# Altium project Control_Quadri.PrjPCB
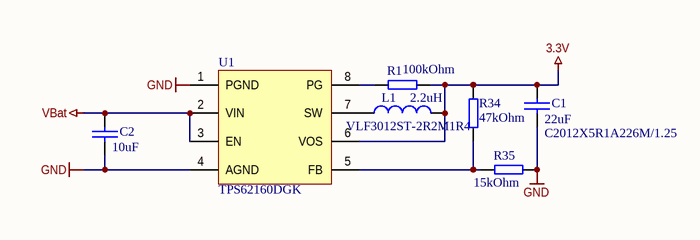
[diagram p0: Alimentation.SchDoc]
6 sheets, 101 parts. Net scope: flat (ports and power ports of the same name join across sheets).
Board file: PCB1.PcbDoc
Sheets:
  Alimentation.SchDoc
  Microcontroleur.SchDoc
  ControlCommande&Motors.SchDoc
  MesureAlimentation.SchDoc
  Capteurs.SchDoc
  InterfaceDataTelemetrie.SchDoc

## Sheet Alimentation.SchDoc
size A3; Organization: Altium Limited; Address1: Laboratoire de Systèmes Embarqués; Address2: 7, rue de la Serre; Address3: 2610 Saint-Imier / Switzerland; PageSetup: Record=PageOptions|CenterHorizontal=True|CenterVertical=True|PrintScale=0.24|XCorrection=1.00|YCorrection=1.00|PrintKind=0|BorderSize=5000000|LeftOffset=0|BottomOffset=0|Orientation=2|PaperLength=1000|PaperWidth=1000|Scale=100|PaperSource=7|PrintQuality=-4|MediaType=1|DitherType=10|PaperKind=A4|PrintScaleMode=1

### Parts
C1  C2012X5R1A226M/1.25  value 22uF  [080501]
C2  value 10uF  [080501]  (hidden comment: GRM21BR61E106KA73L)
L1  VLF3012ST-2R2M1R4  value 2.2uH  [InductanceAlim]
R1  value 100kOhm  [080501]  (hidden comment: ERJ-6GEYJ104V)
R34  value 47kOhm  [080501]  (hidden comment: ERJ-6GEYJ104V)
R35  value 15kOhm  [080501]  (hidden comment: ERJ-6GEYJ104V)
U1  TPS62160DGK  [TSOP65P490-8AM]

### Nets
3.3V: C1.1 L1.2 R1.2 R34.2 U1.6(VOS)
GND: C1.2 C2.2 R35.1 U1.1(PGND) U1.4(AGND)
VBat: C2.1 U1.2(VIN) U1.3(EN)
NetL1_1: L1.1 U1.7(SW)
NetR1_1: R1.1 U1.8(PG)
NetR34_1: R34.1 R35.2 U1.5(FB)

### Notes on the sheet
- Title
- Size:
- Date:
- A3
- Author:
- Time:
- Revision:
- Sheet
- of
- File:

### Library data of the parts
C1 C2 = CAPA: EtatCommande: Interne; Text Field1: CAPA; Supplier 1: Digi-Key
  C1: Supplier Part Number 1: 445-7665-1-ND
  C2: Supplier Part Number 1: 490-5523-1-ND
L1 = INDUCTOR: EtatCommande: Commandé; Text Field1: INDUCTOR; Supplier 1: Digi-Key; Supplier Part Number 1: 445-4200-1-ND
R1 R34 R35 = RES: Text Field1: RESISTANCE; EtatCommande: Interne; Supplier 1: Digi-Key; Supplier Part Number 1: P100KACT-ND
U1 = TPS62160: IC BUCK SYNC ADJ 1A 8MSOP; EtatCommande: Commandé; Part Name: TPS62160DGK; Supplier 1: Digi-Key; Supplier Part Number 1: 296-30318-1-ND

## Sheet Microcontroleur.SchDoc
size A3; PageSetup: Record=PageOptions|CenterHorizontal=True|CenterVertical=True|PrintScale=0.24|XCorrection=1.00|YCorrection=1.00|PrintKind=0|BorderSize=5000000|LeftOffset=0|BottomOffset=0|Orientation=2|PaperLength=1000|PaperWidth=1000|Scale=100|PaperSource=7|PrintQuality=-4|MediaType=1|DitherType=10|PaperKind=A4|PrintScaleMode=1; Organization: Altium Limited; Address1: Laboratoire de Systèmes Embarqués; Address2: 7, rue de la Serre; Address3: 2610 Saint-Imier / Switzerland
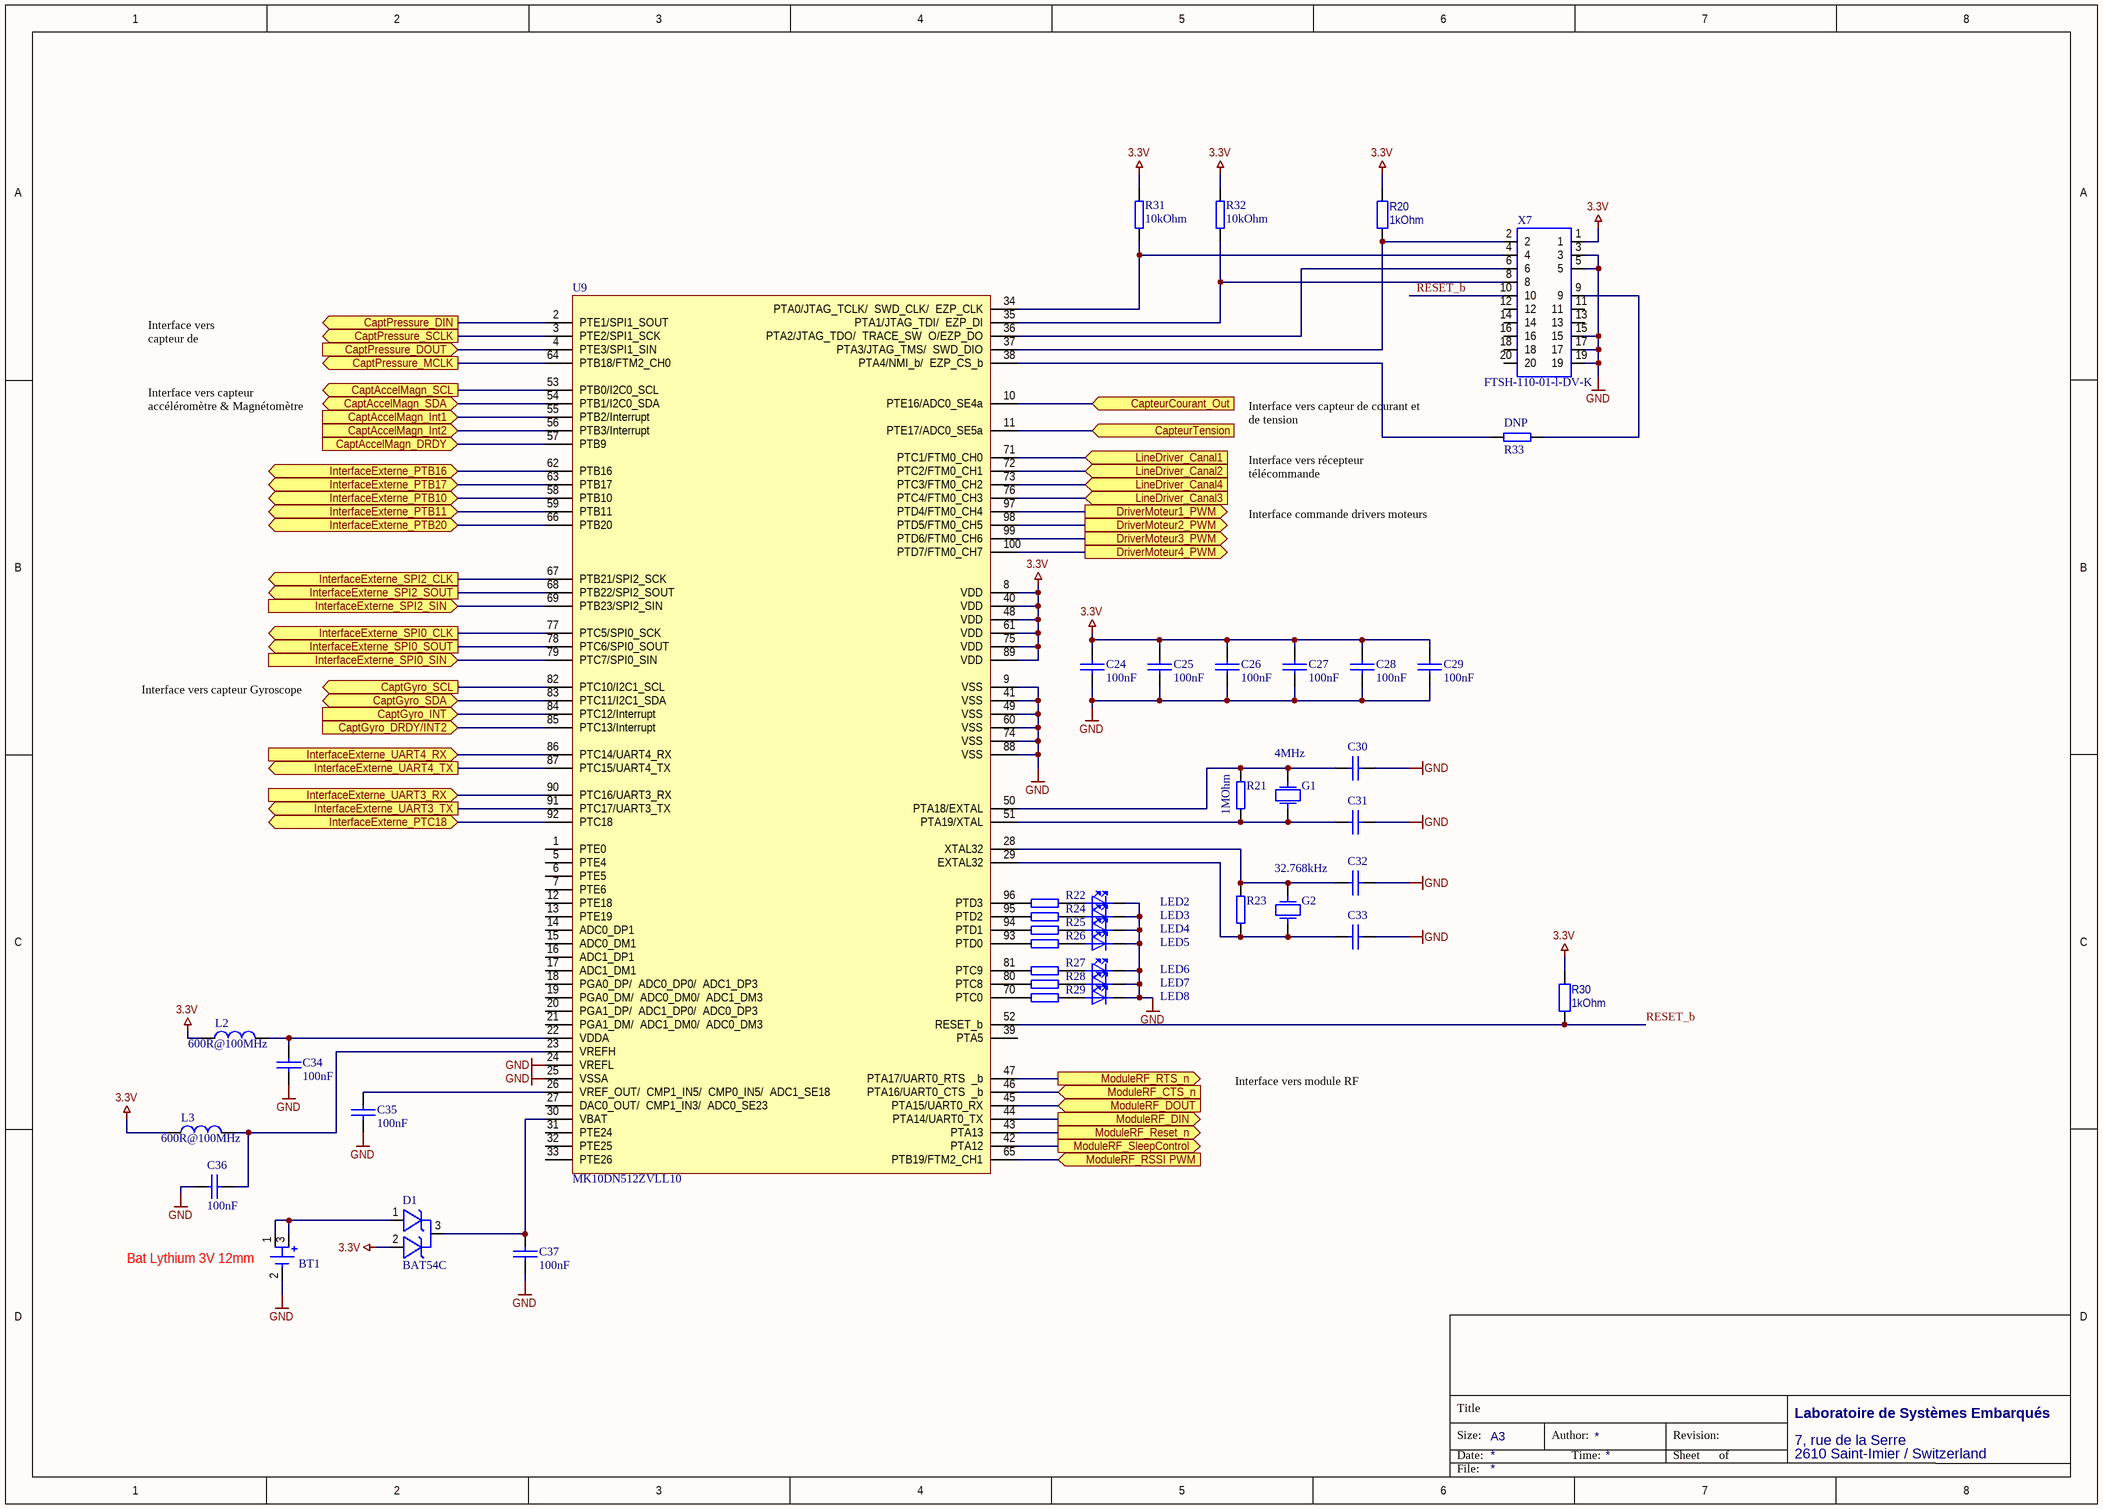
[diagram p1: Microcontroleur.SchDoc]

### Parts
BT1  3000TR  [3000TR]  (value not drawn)
C24  value 100nF  [060301]  (hidden comment: GRM188R71E104KA01D)
C25  value 100nF  [060301]  (hidden comment: GRM188R71E104KA01D)
C26  value 100nF  [060301]  (hidden comment: GRM188R71E104KA01D)
C27  value 100nF  [060301]  (hidden comment: GRM188R71E104KA01D)
C28  value 100nF  [060301]  (hidden comment: GRM188R71E104KA01D)
C29  value 100nF  [060301]  (hidden comment: GRM188R71E104KA01D)
C30  GQM2195C1H200JB01D  [060301]  (value not drawn)
C31  GQM2195C1H200JB01D  [080501]  (value not drawn)
C32  GRM21A5C2E120JW01D  [080501]  (value not drawn)
C33  GRM21A5C2E120JW01D  [080501]  (value not drawn)
C34  value 100nF  [060301]  (hidden comment: GRM188R71E104KA01D)
C35  value 100nF  [060301]  (hidden comment: GRM188R71E104KA01D)
C36  value 100nF  [060301]  (hidden comment: GRM188R71E104KA01D)
C37  value 100nF  [060301]  (hidden comment: GRM188R71E104KA01D)
D1  BAT54C  [SOT2301]
G1  value 4MHz  [Crystal]  (hidden comment: ECS-40-20-5PX-TR)
G2  value 32.768kHz  [Crystal2]  (hidden comment: ECS-.327-12.5-38)
L2  value 600R@100MHz  [080501]  (hidden comment: BLM21AG601SN1D)
L3  value 600R@100MHz  [080501]  (hidden comment: BLM21AG601SN1D)
LED2  LG L29K-G2J1-24-Z  [060301_led]  (value not drawn)
LED3  LG L29K-G2J1-24-Z  [060301_led]  (value not drawn)
LED4  LG L29K-G2J1-24-Z  [060301_led]  (value not drawn)
LED5  LG L29K-G2J1-24-Z  [060301_led]  (value not drawn)
LED6  LG L29K-G2J1-24-Z  [060301_led]  (value not drawn)
LED7  LG L29K-G2J1-24-Z  [060301_led]  (value not drawn)
LED8  LG L29K-G2J1-24-Z  [060301_led]  (value not drawn)
R20  value 1kOhm  [060301]  (hidden comment: RC0603FR-071KL)
R21  value 1MOhm  [080501]  (hidden comment: RMCF0805JT820R)
R22  RMCF0805JT820R  [080501]  (value not drawn)
R23  ERJ-6GEYJ103V  [080501]  (value not drawn)
R24  RMCF0805JT820R  [080501]  (value not drawn)
R25  RMCF0805JT820R  [080501]  (value not drawn)
R26  RMCF0805JT820R  [080501]  (value not drawn)
R27  RMCF0805JT820R  [080501]  (value not drawn)
R28  RMCF0805JT820R  [080501]  (value not drawn)
R29  RMCF0805JT820R  [080501]  (value not drawn)
R30  value 1kOhm  [060301]  (hidden comment: RC0603FR-071KL)
R31  value 10kOhm  [080501]  (hidden comment: ERJ-6GEYJ103V)
R32  value 10kOhm  [080501]  (hidden comment: ERJ-6GEYJ103V)
R33  value DNP  [080501]  (hidden comment: RMCF0805JT820R)
U9  MK10DN512ZVLL10  [QFP100-1]
X7  FTSH-110-01-l-DV-K  [FTSH-110-01-X-DV-EJ]

### Ports
CaptAccelMagn_DRDY (in), CaptAccelMagn_Int1 (in), CaptAccelMagn_Int2 (in), CaptAccelMagn_SCL (out), CaptAccelMagn_SDA (bidir), CapteurCourant_Out (in), CapteurTension (in), CaptGyro_DRDY/INT2 (in), CaptGyro_INT (in), CaptGyro_SCL (out), CaptGyro_SDA (bidir), CaptPressure_DIN (out), CaptPressure_DOUT (in), CaptPressure_MCLK (out), CaptPressure_SCLK (out), DriverMoteur1_PWM (out), DriverMoteur2_PWM (out), DriverMoteur3_PWM (out), DriverMoteur4_PWM (out), InterfaceExterne_PTB10 (bidir), InterfaceExterne_PTB11 (bidir), InterfaceExterne_PTB16 (bidir), InterfaceExterne_PTB17 (bidir), InterfaceExterne_PTB20 (bidir), InterfaceExterne_PTC18 (bidir), InterfaceExterne_SPI0_CLK (out), InterfaceExterne_SPI0_SIN (in), InterfaceExterne_SPI0_SOUT (out), InterfaceExterne_SPI2_CLK (out), InterfaceExterne_SPI2_SIN (in), InterfaceExterne_SPI2_SOUT (out), InterfaceExterne_UART3_RX (in), InterfaceExterne_UART3_TX (out), InterfaceExterne_UART4_RX (in), InterfaceExterne_UART4_TX (out), LineDriver_Canal1 (in), LineDriver_Canal2 (in), LineDriver_Canal3 (in), LineDriver_Canal4 (in), ModuleRF_CTS_n (in), ModuleRF_DIN (out), ModuleRF_DOUT (in), ModuleRF_Reset_n (out), ModuleRF_RSSI PWM (in), ModuleRF_RTS_n (out), ModuleRF_SleepControl (out)

### Nets
3.3V: C24.1 C25.1 C26.1 C27.1 C28.1 C29.1 D1.2(C2) L2.1 L3.1 R20.1 R30.1 R31.2 R32.2 U9.8(VDD) U9.40(VDD) U9.48(VDD) U9.61(VDD) U9.75(VDD) U9.89(VDD) X7.1
GND: BT1.2(C) C24.2 C25.2 C26.2 C27.2 C28.2 C29.2 C30.2 C31.2 C32.2 C33.2 C34.2 C35.1 C36.1 C37.1 LED2.2(CATHODE) LED3.2(CATHODE) LED4.2(CATHODE) LED5.2(CATHODE) LED6.2(CATHODE) LED7.2(CATHODE) LED8.2(CATHODE) U9.9(VSS) U9.24(VREFL) U9.25(VSSA) U9.41(VSS) U9.49(VSS) U9.60(VSS) U9.74(VSS) U9.88(VSS) X7.3 X7.5 X7.15 X7.17 X7.19
RESET_b: R30.2 U9.52(RESET_b) X7.10
NetBT1_1: BT1.1(A1) BT1.3(A2) D1.1(C1)
NetC23_1: U9.10(PTE16/ADC0_SE4a) ; port CapteurCourant_Out
NetC30_1: C30.1 G1.1 R21.2 U9.50(PTA18/EXTAL)
NetC31_1: C31.1 G1.2 R21.1 U9.51(PTA19/XTAL)
NetC32_1: C32.1 G2.2 R23.2 U9.28(XTAL32)
NetC33_1: C33.1 G2.1 R23.1 U9.29(EXTAL32)
NetC34_1: C34.1 L2.2 U9.22(VDDA)
NetC35_2: C35.2 U9.26(VREF_OUT/__CMP1_IN5/__CMP0_IN5/__ADC1_SE18)
NetC36_2: C36.2 L3.2 U9.23(VREFH)
NetC37_2: C37.2 D1.3(Anode) U9.30(VBAT)
NetLED2_1: LED2.1(ANODE) R24.2
NetLED3_1: LED3.1(ANODE) R22.2
NetLED4_1: LED4.1(ANODE) R25.2
NetLED5_1: LED5.1(ANODE) R26.2
NetLED6_1: LED6.1(ANODE) R27.2
NetLED7_1: LED7.1(ANODE) R28.2
NetLED8_1: LED8.1(ANODE) R29.2
NetR2_1: U9.53(PTB0/I2C0_SCL) ; port CaptAccelMagn_SCL
NetR3_1: U9.54(PTB1/I2C0_SDA) ; port CaptAccelMagn_SDA
NetR4_1: U9.82(PTC10/I2C1_SCL) ; port CaptGyro_SCL
NetR5_1: U9.83(PTC11/I2C1_SDA) ; port CaptGyro_SDA
NetR18_2: U9.11(PTE17/ADC0_SE5a) ; port CapteurTension
NetR20_2: R20.2 U9.37(PTA3/JTAG_TMS/__SWD_DIO) X7.2
NetR22_1: R22.1 U9.96(PTD3)
NetR24_1: R24.1 U9.95(PTD2)
NetR25_1: R25.1 U9.94(PTD1)
NetR26_1: R26.1 U9.93(PTD0)
NetR27_1: R27.1 U9.81(PTC9)
NetR28_1: R28.1 U9.80(PTC8)
NetR29_1: R29.1 U9.70(PTC0)
NetR31_1: R31.1 U9.34(PTA0/JTAG_TCLK/__SWD_CLK/__EZP_CLK) X7.4
NetR32_1: R32.1 U9.35(PTA1/JTAG_TDI/__EZP_DI) X7.8
NetR33_1: R33.1 X7.9
NetR33_2: R33.2 U9.38(PTA4/NMI_b/__EZP_CS_b)
NetU2_2: U9.3(PTE2/SPI1_SCK) ; port CaptPressure_SCLK
NetU2_3: U9.4(PTE3/SPI1_SIN) ; port CaptPressure_DOUT
NetU2_4: U9.2(PTE1/SPI1_SOUT) ; port CaptPressure_DIN
NetU2_5: U9.64(PTB18/FTM2_CH0) ; port CaptPressure_MCLK
NetU3_4: U9.56(PTB3/Interrupt) ; port CaptAccelMagn_Int2
NetU3_5: U9.55(PTB2/Interrupt) ; port CaptAccelMagn_Int1
NetU3_9: U9.57(PTB9) ; port CaptAccelMagn_DRDY
NetU4_6: U9.85(PTC13/Interrupt) ; port CaptGyro_DRDY/INT2
NetU4_7: U9.84(PTC12/Interrupt) ; port CaptGyro_INT
NetU5_2: U9.71(PTC1/FTM0_CH0) ; port LineDriver_Canal1
NetU5_4: U9.72(PTC2/FTM0_CH1) ; port LineDriver_Canal2
NetU5_6: U9.76(PTC4/FTM0_CH3) ; port LineDriver_Canal3
NetU5_8: U9.73(PTC3/FTM0_CH2) ; port LineDriver_Canal4
NetU6_1: U9.97(PTD4/FTM0_CH4) ; port DriverMoteur1_PWM
NetU6_3: U9.98(PTD5/FTM0_CH5) ; port DriverMoteur2_PWM
NetU6_5: U9.99(PTD6/FTM0_CH6) ; port DriverMoteur3_PWM
NetU6_9: U9.100(PTD7/FTM0_CH7) ; port DriverMoteur4_PWM
NetU7_2: U9.45(PTA15/UART0_RX) ; port ModuleRF_DOUT
NetU7_3: U9.44(PTA14/UART0_TX) ; port ModuleRF_DIN
NetU7_5: U9.43(PTA13) ; port ModuleRF_Reset_n
NetU7_6: U9.65(PTB19/FTM2_CH1) ; port ModuleRF_RSSI PWM
NetU7_9: U9.42(PTA12) ; port ModuleRF_SleepControl
NetU7_12: U9.46(PTA16/UART0_CTS___b) ; port ModuleRF_CTS_n
NetU7_16: U9.47(PTA17/UART0_RTS___b) ; port ModuleRF_RTS_n
NetU9_36: U9.36(PTA2/JTAG_TDO/__TRACE_SW__O/EZP_DO) X7.6
NetU9_58: U9.58(PTB10) ; port InterfaceExterne_PTB10
NetU9_59: U9.59(PTB11) ; port InterfaceExterne_PTB11
NetU9_62: U9.62(PTB16) ; port InterfaceExterne_PTB16
NetU9_63: U9.63(PTB17) ; port InterfaceExterne_PTB17
NetU9_66: U9.66(PTB20) ; port InterfaceExterne_PTB20
NetU9_67: U9.67(PTB21/SPI2_SCK) ; port InterfaceExterne_SPI2_CLK
NetU9_68: U9.68(PTB22/SPI2_SOUT) ; port InterfaceExterne_SPI2_SOUT
NetU9_69: U9.69(PTB23/SPI2_SIN) ; port InterfaceExterne_SPI2_SIN
NetU9_77: U9.77(PTC5/SPI0_SCK) ; port InterfaceExterne_SPI0_CLK
NetU9_78: U9.78(PTC6/SPI0_SOUT) ; port InterfaceExterne_SPI0_SOUT
NetU9_79: U9.79(PTC7/SPI0_SIN) ; port InterfaceExterne_SPI0_SIN
NetU9_86: U9.86(PTC14/UART4_RX) ; port InterfaceExterne_UART4_RX
NetU9_87: U9.87(PTC15/UART4_TX) ; port InterfaceExterne_UART4_TX
NetU9_90: U9.90(PTC16/UART3_RX) ; port InterfaceExterne_UART3_RX
NetU9_91: U9.91(PTC17/UART3_TX) ; port InterfaceExterne_UART3_TX
NetU9_92: U9.92(PTC18) ; port InterfaceExterne_PTC18

Not connected (* = marked no-connect by the designer): U9 1(PTE0) 5(PTE4) 6(PTE5) 7(PTE6) 12(PTE18) 13(PTE19) 14(ADC0_DP1) 15(ADC0_DM1) 16(ADC1_DP1) 17(ADC1_DM1) 18(PGA0_DP/__ADC0_DP0/__ADC1_DP3) 19(PGA0_DM/__ADC0_DM0/__ADC1_DM3) 20(PGA1_DP/__ADC1_DP0/__ADC0_DP3) 21(PGA1_DM/__ADC1_DM0/__ADC0_DM3) 27(DAC0_OUT/__CMP1_IN3/__ADC0_SE23) 31(PTE24) 32(PTE25) 33(PTE26) 39(PTA5); X7 11 12 13 14 16 18 20

### Notes on the sheet
- Interface vers capteur de pression
- Interface vers capteur accéléromètre & Magnétomètre
- Interface vers capteur de courant et de tension
- Interface vers récepteur télécommande
- Interface commande drivers moteurs
- Interface vers capteur Gyroscope
- Interface vers module RF
- (near BT1) Bat Lythium 3V 12mm
- Title
- Size:
- Date:
- A3
- Author:
- Time:
- Revision:
- Sheet
- of
- File:

### Library data of the parts
BT1 = BAT_1: HOLDER BATTERY COIN 12MM DIA SMD; Manufacturer: Keystone Electronics; EtatCommande: Commandé; Supplier 1: Digi-Key; Supplier Part Number 1: 3000KTR-ND; Part Name: 3000TR
C24-C29 C34-C37 = CAPA: EtatCommande: Interne; Text Field1: CAPA; Supplier 1: Digi-Key; Supplier Part Number 1: 490-1524-1-ND
C30 C31 = CAPA: Value: 20pF; EtatCommande: Interne; Text Field1: CAPA; Supplier 1: Digi-Key; Supplier Part Number 1: 490-3607-1-ND
C32 C33 = CAPA: Value: 12pF; EtatCommande: Interne; Text Field1: CAPA; Supplier 1: Digi-Key; Supplier Part Number 1: 490-5531-1-ND
D1 = BAT54C: DIODE SCHTTKY CC 200MA 30V SOT23; Manufacturer: Comchip Technology; Part Name: BAT54C-G; EtatCommande: Commandé; Supplier 1: Digi-Key; Supplier Part Number 1: 641-1320-1-ND
G1 = CRYSTAL: EtatCommande: Commandé; Text Field1: CRYSTAL; Supplier 1: Digi-Key; Supplier Part Number 1: XC1238CT-ND
G2 = CRYSTAL: EtatCommande: Interne; Text Field1: CRYSTAL; Supplier 1: Digi-Key; Supplier Part Number 1: XC1616CT-ND
L2 L3 = Ferrite Bead: FERRITE CHIP 600 OHM 200MA 0805; Manufacturer: Murata Electronics; EtatCommande: Commandé; Part Name: BLM21AG601SN1D; Supplier 1: Digi-Key; Supplier Part Number 1: 490-1040-6-ND
LED2-LED8 = LED: EtatCommande: Commandé; Supplier 1: Digi-Key; Supplier Part Number 1: 475-2709-1-ND; Text Field1: LED
R20 R30 = RES: RES 1.00K OHM 1/10W 1% 0603 SMD; Manufacturer: Yageo; EtatCommande: Interne; Text Field1: RESISTANCE; Part Name: RC0603FR-071KL; Supplier 1: Digi-Key; Supplier Part Number 1: 311-1.00KHRCT-ND
R21 R31-R33 = RES: as R1 on sheet Alimentation
  R21: Supplier 1: Digi-Key; Supplier Part Number 1: RMCF0805JT820RDKR-ND
  R31 R32: Supplier 1: Digi-Key; Supplier Part Number 1: P10KACT-ND
R22 R24-R29 = RES: Text Field1: RESISTANCE; Value: 820Ohm; EtatCommande: Interne; Supplier 1: Digi-Key; Supplier Part Number 1: RMCF0805JT820RDKR-ND
R23 = RES: Text Field1: RESISTANCE; Value: 10kOhm; EtatCommande: Interne; Supplier 1: Digi-Key; Supplier Part Number 1: P10KADKR-ND
X7 = CON20_JTAG: CONN UNSHROUDED HDR 20POS .05"; Manufacturer: Samtec Inc; Part Name: FTSH-110-01-L-DV-K-P-TR; Supplier 1: Samtec Inc; Supplier Part Number 1: FTSH-110-01-L-DV-K-P-TR

## Sheet ControlCommande&Motors.SchDoc
size A3; Organization: Altium Limited; Address1: Laboratoire de Systèmes Embarqués; Address2: 7, rue de la Serre; Address3: 2610 Saint-Imier / Switzerland; PageSetup: Record=PageOptions|CenterHorizontal=True|CenterVertical=True|PrintScale=0.24|XCorrection=1.00|YCorrection=1.00|PrintKind=0|BorderSize=5000000|LeftOffset=0|BottomOffset=0|Orientation=2|PaperLength=1000|PaperWidth=1000|Scale=100|PaperSource=7|PrintQuality=-4|MediaType=1|DitherType=10|PaperKind=A4|PrintScaleMode=1
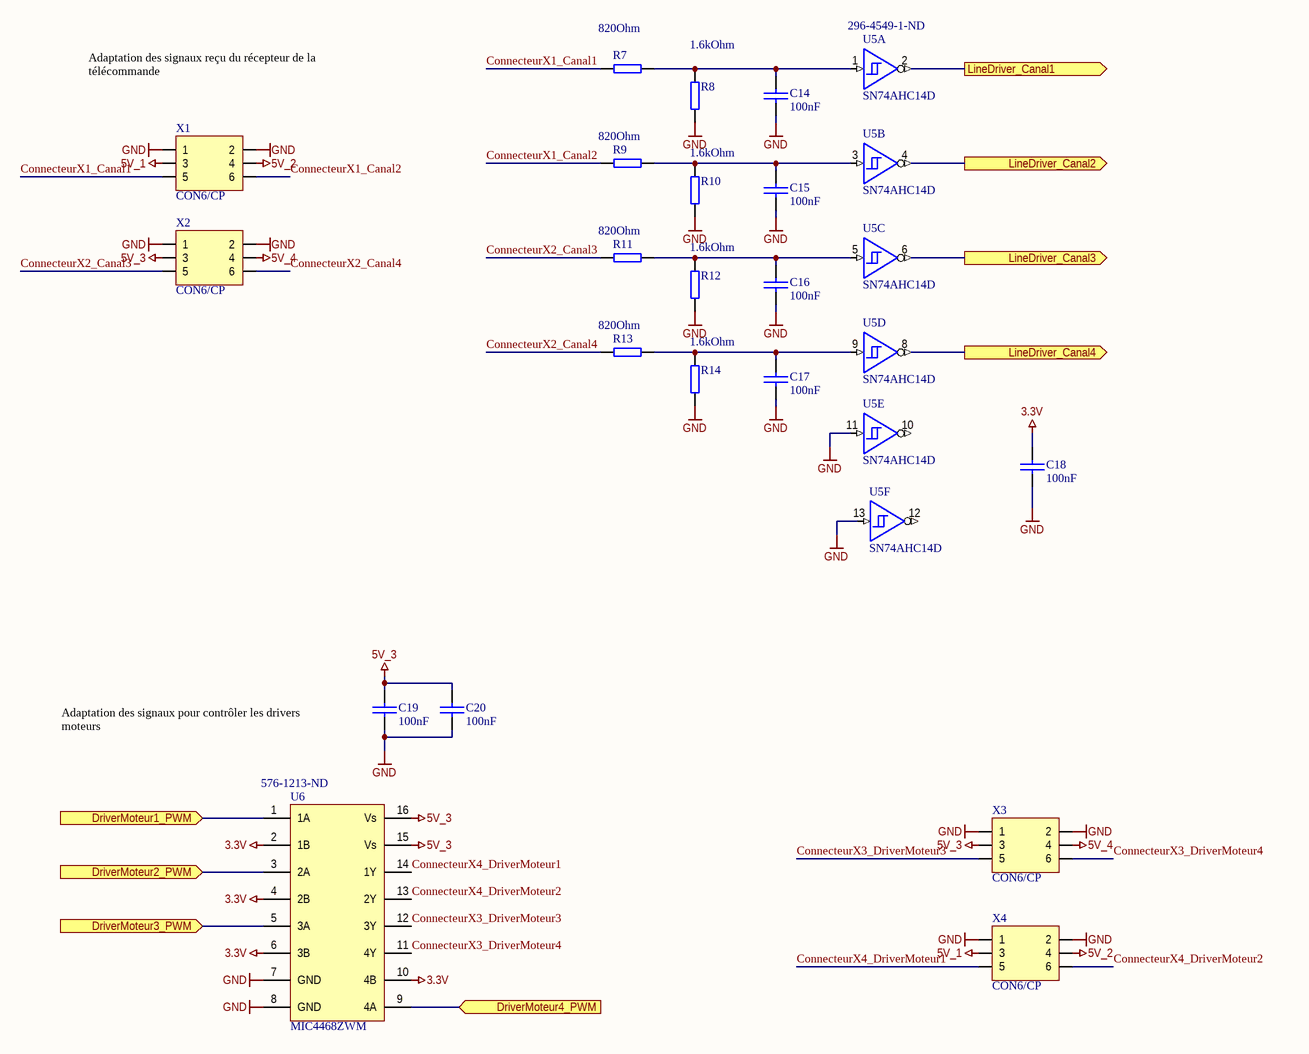
[diagram p2: ControlCommande&Motors.SchDoc]

### Parts
C14  value 100nF  [060301]  (hidden comment: GRM188R71E104KA01D)
C15  value 100nF  [060301]  (hidden comment: GRM188R71E104KA01D)
C16  value 100nF  [060301]  (hidden comment: GRM188R71E104KA01D)
C17  value 100nF  [060301]  (hidden comment: GRM188R71E104KA01D)
C18  value 100nF  [060301]  (hidden comment: GRM188R71E104KA01D)
C19  value 100nF  [060301]  (hidden comment: GRM188R71E104KA01D)
C20  value 100nF  [060301]  (hidden comment: GRM188R71E104KA01D)
R7  value 820Ohm  [080501]  (hidden comment: RMCF0805JT820R)
R8  value 1.6kOhm  [080501]  (hidden comment: ERJ-6GEYJ162V)
R9  value 820Ohm  [080501]  (hidden comment: RMCF0805JT820R)
R10  value 1.6kOhm  [080501]  (hidden comment: ERJ-6GEYJ162V)
R11  value 820Ohm  [080501]  (hidden comment: RMCF0805JT820R)
R12  value 1.6kOhm  [080501]  (hidden comment: ERJ-6GEYJ162V)
R13  value 820Ohm  [080501]  (hidden comment: RMCF0805JT820R)
R14  value 1.6kOhm  [080501]  (hidden comment: ERJ-6GEYJ162V)
U5  SN74AHC14D  Supplier Part Number 1: 296-4549-1-ND  [SO1401]  (parts A,B,C,D,E,F of 6)
U6  MIC4468ZWM  Supplier Part Number 1: 576-1213-ND  [SOIC127P1030-16M]
X1  CON6/CP  [J2X3_2.54]
X2  CON6/CP  [J2X3_2.54]
X3  CON6/CP  [J2X3_2.54]
X4  CON6/CP  [J2X3_2.54]

### Ports
DriverMoteur1_PWM (in), DriverMoteur2_PWM (in), DriverMoteur3_PWM (in), DriverMoteur4_PWM (in), LineDriver_Canal1 (out), LineDriver_Canal2 (out), LineDriver_Canal3 (out), LineDriver_Canal4 (out)

### Nets
3.3V: C18.1 U5.14(3.3V) U6.2(1B) U6.4(2B) U6.6(3B) U6.10(4B)
5V_1: X1.3 X4.3
5V_2: X1.4 X4.4
5V_3: C19.1 C20.1 U6.15(Vs) U6.16(Vs) X2.3 X3.3
5V_4: X2.4 X3.4
GND: C14.2 C15.2 C16.2 C17.2 C18.2 C19.2 C20.2 R8.2 R10.2 R12.2 R14.2 U5.7(GND) U5.11 U5.13 U6.7(GND) U6.8(GND) X1.1 X1.2 X2.1 X2.2 X3.1 X3.2 X4.1 X4.2
ConnecteurX1_Canal1: R7.1 X1.5
ConnecteurX1_Canal2: R9.1 X1.6
ConnecteurX2_Canal3: R11.1 X2.5
ConnecteurX2_Canal4: R13.1 X2.6
ConnecteurX3_DriverMoteur3: U6.12(3Y) X3.5
ConnecteurX3_DriverMoteur4: U6.11(4Y) X3.6
ConnecteurX4_DriverMoteur1: U6.14(1Y) X4.5
ConnecteurX4_DriverMoteur2: U6.13(2Y) X4.6
NetC14_1: C14.1 R7.2 R8.1 U5.1
NetC15_1: C15.1 R9.2 R10.1 U5.3
NetC16_1: C16.1 R11.2 R12.1 U5.5
NetC17_1: C17.1 R13.2 R14.1 U5.9
NetU5_2: U5.2 ; port LineDriver_Canal1
NetU5_4: U5.4 ; port LineDriver_Canal2
NetU5_6: U5.6 ; port LineDriver_Canal3
NetU5_8: U5.8 ; port LineDriver_Canal4
NetU6_1: U6.1(1A) ; port DriverMoteur1_PWM
NetU6_3: U6.3(2A) ; port DriverMoteur2_PWM
NetU6_5: U6.5(3A) ; port DriverMoteur3_PWM
NetU6_9: U6.9(4A) ; port DriverMoteur4_PWM

Not connected (* = marked no-connect by the designer): U5 10 12

### Notes on the sheet
- (near X1) Adaptation des signaux reçu du récepteur de la télécommande
- Adaptation des signaux pour contrôler les drivers moteurs
- Title
- Size:
- Date:
- A3
- Author:
- Time:
- Revision:
- Sheet
- of
- File:

### Library data of the parts
C14-C20 = CAPA: EtatCommande: Interne; Text Field1: CAPA; Supplier 1: Digi-Key; Supplier Part Number 1: 490-1524-1-ND
R7-R14 = RES: as R1 on sheet Alimentation; Supplier 1: Digi-Key
  R7 R9 R11 R13: Supplier Part Number 1: RMCF0805JT820RDKR-ND
  R8 R10 R12 R14: Supplier Part Number 1: P1.6KACT-ND
U5 = SN74AHC14D: EtatCommande: Commandé; Supplier 1: Digi-Key
U6 = MIC4468: EtatCommande: Commandé; Supplier 1: Digi-Key
X1 = CON6/CP: Connecteur récepteur télécommande cannaux 1 & 2; EtatCommande: Interne
X2 = CON6/CP: Connecteur récepteur télécommande cannaux 3 & 4; EtatCommande: Interne
X3 = CON6/CP: Connecteur contrôleur moteurs 3 (arrière) & 4 (gauche); EtatCommande: Interne
X4 = CON6/CP: Connecteur contrôleur moteurs 1 (avant) & 2 (droite); EtatCommande: Interne

## Sheet MesureAlimentation.SchDoc
size A3; Organization: Altium Limited; Address1: Laboratoire de Systèmes Embarqués; Address2: 7, rue de la Serre; Address3: 2610 Saint-Imier / Switzerland; PageSetup: Record=PageOptions|CenterHorizontal=True|CenterVertical=True|PrintScale=0.24|XCorrection=1.00|YCorrection=1.00|PrintKind=0|BorderSize=5000000|LeftOffset=0|BottomOffset=0|Orientation=2|PaperLength=1000|PaperWidth=1000|Scale=100|PaperSource=7|PrintQuality=-4|MediaType=1|DitherType=10|PaperKind=A4|PrintScaleMode=1
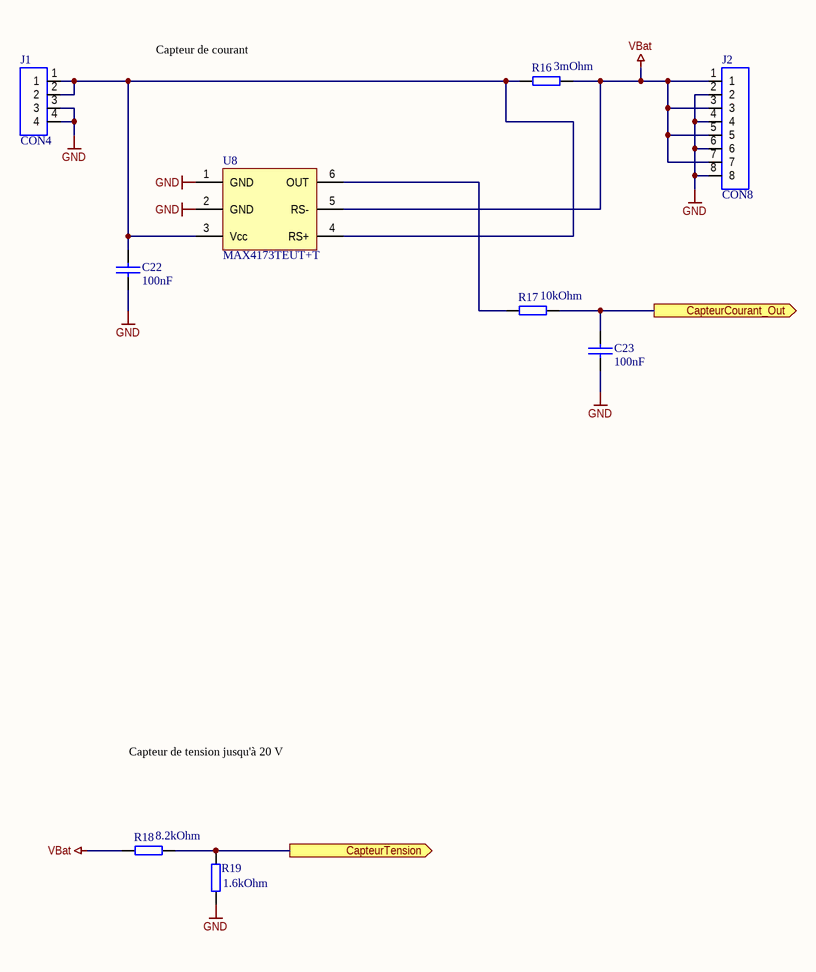
[diagram p3: MesureAlimentation.SchDoc]

### Parts
C22  value 100nF  [060301]  (hidden comment: GRM188R71E104KA01D)
C23  value 100nF  [060301]  (hidden comment: GRM188R71E104KA01D)
J1  CON4  [SL354D]
J2  CON8  [SL358D]
R16  value 3mOhm  [5.2x8.75]  (hidden comment: WSLP59313L000FEB)
R17  value 10kOhm  [080501]  (hidden comment: ERJ-6GEYJ103V)
R18  value 8.2kOhm  [080501]  (hidden comment: ERJ-6GEYJ822V)
R19  value 1.6kOhm  [080501]  (hidden comment: ERJ-6GEYJ162V)
U8  MAX4173TEUT+T  [SOT26A-6AM]

### Ports
CapteurCourant_Out (out), CapteurTension (out)

### Nets
GND: C22.2 C23.2 J1.3 J1.4 J2.2 J2.4 J2.6 J2.8 R19.2 U8.1(GND) U8.2(GND)
VBat: J2.1 J2.3 J2.5 J2.7 R16.2 R18.1 U8.5(RS-)
NetC22_1: C22.1 J1.1 J1.2 R16.1 U8.3(Vcc) U8.4(RS+)
NetC23_1: C23.1 R17.2 ; port CapteurCourant_Out
NetR17_1: R17.1 U8.6(OUT)
NetR18_2: R18.2 R19.1 ; port CapteurTension

### Notes on the sheet
- Capteur de courant
- Capteur de tension jusqu'à 20 V
- Title
- Size:
- Date:
- A3
- Author:
- Time:
- Revision:
- Sheet
- of
- File:

### Library data of the parts
C22 C23 = CAPA: EtatCommande: Interne; Text Field1: CAPA; Supplier 1: Digi-Key; Supplier Part Number 1: 490-1524-1-ND
J2 = CON8: Text Field1: CON; EtatCommande: Commandé; Supplier 1: Distrelec; Supplier Part Number 1: 141525
R16 = RES: Text Field1: RESISTANCE; EtatCommande: Commandé; Supplier 1: Digi-Key; Supplier Part Number 1: WSLPD-.003CT-ND
R17-R19 = RES: as R1 on sheet Alimentation; Supplier 1: Digi-Key
  R17: Supplier Part Number 1: P10KACT-ND
  R18: Supplier Part Number 1: P8.2KACT-ND
  R19: Supplier Part Number 1: P1.6KACT-ND
U8 = Max4173: Amplificateur capteur de courant; EtatCommande: Commandé; Supplier 1: Digi-Key; Supplier Part Number 1: MAX4173TEUT+TCT-ND

## Sheet Capteurs.SchDoc
size A3; Organization: Altium Limited; Address1: Laboratoire de Systèmes Embarqués; Address2: 7, rue de la Serre; Address3: 2610 Saint-Imier / Switzerland; PageSetup: Record=PageOptions|CenterHorizontal=True|CenterVertical=True|PrintScale=0.24|XCorrection=1.00|YCorrection=1.00|PrintKind=0|BorderSize=5000000|LeftOffset=0|BottomOffset=0|Orientation=2|PaperLength=1000|PaperWidth=1000|Scale=100|PaperSource=7|PrintQuality=-4|MediaType=1|DitherType=10|PaperKind=A4|PrintScaleMode=1
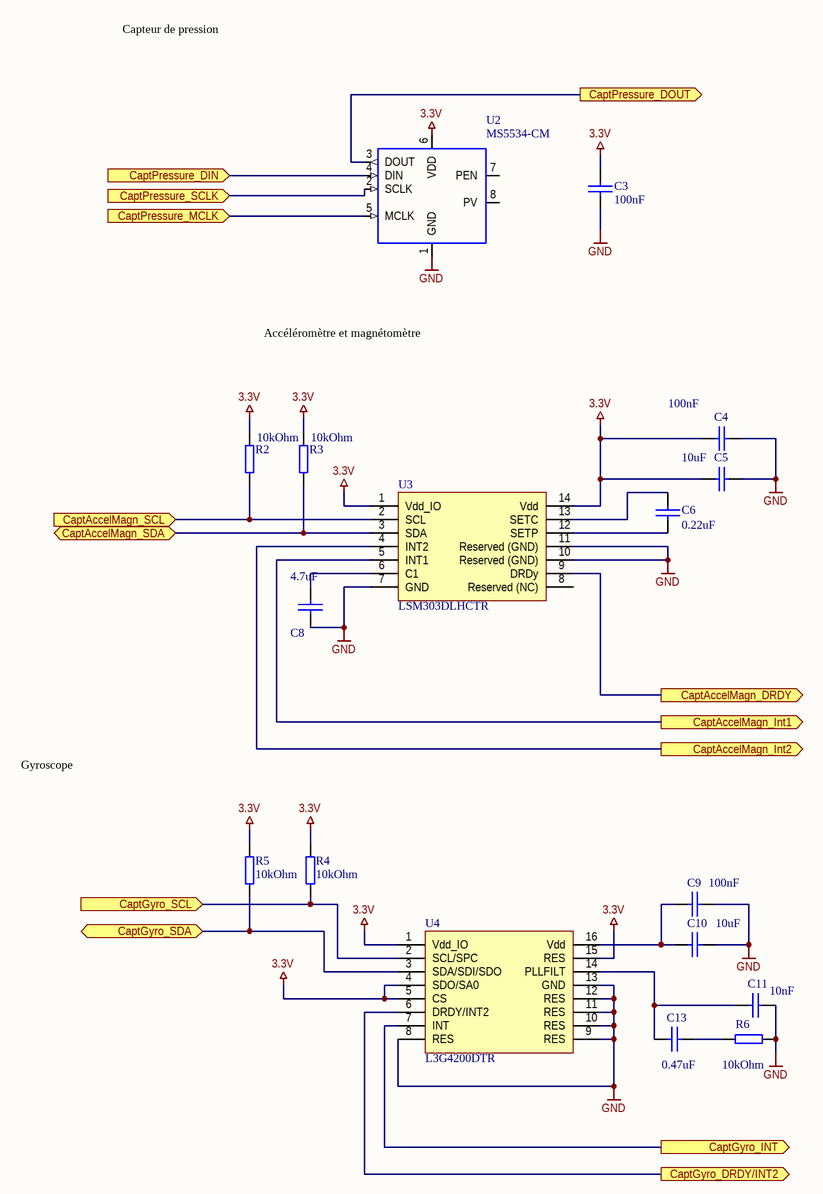
[diagram p4: Capteurs.SchDoc]

### Parts
C3  value 100nF  [060301]  (hidden comment: GRM188R71E104KA01D)
C4  value 100nF  [060301]  (hidden comment: GRM188R71E104KA01D)
C5  value 10uF  [080501]  (hidden comment: 08056D106KAT2A)
C6  value 0.22uF  [120601]  (hidden comment: UMK212F224ZD-T)
C8  value 4.7uF  [080501]  (hidden comment: C0805C475K4PACTU)
C9  value 100nF  [060301]  (hidden comment: GRM188R71E104KA01D)
C10  value 10uF  [080501]  (hidden comment: 08056D106KAT2A)
C11  value 10nF  [080501]  (hidden comment: C0805C103K4RACTU)
C13  value 0.47uF  [060301]  (hidden comment: C2012Y5V1H474Z/0.85)
R2  value 10kOhm  [080501]  (hidden comment: ERJ-6GEYJ103V)
R3  value 10kOhm  [080501]  (hidden comment: ERJ-6GEYJ103V)
R4  value 10kOhm  [080501]  (hidden comment: ERJ-6GEYJ103V)
R5  value 10kOhm  [080501]  (hidden comment: ERJ-6GEYJ103V)
R6  value 10kOhm  [080501]  (hidden comment: ERJ-6GEYJ103V)
U2  MS5534-CM  [MS5534B]
U3  LSM303DLHCTR  [LGA-14L]
U4  L3G4200DTR  [LGA-16]

### Ports
CaptAccelMagn_DRDY (out), CaptAccelMagn_Int1 (out), CaptAccelMagn_Int2 (out), CaptAccelMagn_SCL (in), CaptAccelMagn_SDA (bidir), CaptGyro_DRDY/INT2 (out), CaptGyro_INT (out), CaptGyro_SCL (in), CaptGyro_SDA (bidir), CaptPressure_DIN (in), CaptPressure_DOUT (out), CaptPressure_MCLK (in), CaptPressure_SCLK (in)

### Nets
3.3V: C3.1 C4.2 C5.2 R2.2 R3.2 R4.2 R5.2 U2.6(VDD) U3.1(Vdd_IO) U3.14(Vdd) U4.1(Vdd_IO) U4.4(SDO/SA0) U4.5(CS) U4.15(RES)
GND: C3.2 C4.1 C5.1 C8.2 C9.1 C10.1 C11.1 R6.2 U2.1(GND) U3.7(GND) U3.10(Reserved_(GND)) U3.11(Reserved_(GND)) U4.8(RES) U4.9(RES) U4.10(RES) U4.11(RES) U4.12(RES) U4.13(GND)
NetC6_1: C6.1 U3.12(SETP)
NetC6_2: C6.2 U3.13(SETC)
NetC8_1: C8.1 U3.6(C1)
NetC9_2: C9.2 C10.2 U4.16(Vdd)
NetC11_2: C11.2 C13.2 U4.14(PLLFILT)
NetC13_1: C13.1 R6.1
NetR2_1: R2.1 U3.2(SCL) ; port CaptAccelMagn_SCL
NetR3_1: R3.1 U3.3(SDA) ; port CaptAccelMagn_SDA
NetR4_1: R4.1 U4.2(SCL/SPC) ; port CaptGyro_SCL
NetR5_1: R5.1 U4.3(SDA/SDI/SDO) ; port CaptGyro_SDA
NetU2_2: U2.2(SCLK) ; port CaptPressure_SCLK
NetU2_3: U2.3(DOUT) ; port CaptPressure_DOUT
NetU2_4: U2.4(DIN) ; port CaptPressure_DIN
NetU2_5: U2.5(MCLK) ; port CaptPressure_MCLK
NetU3_4: U3.4(INT2) ; port CaptAccelMagn_Int2
NetU3_5: U3.5(INT1) ; port CaptAccelMagn_Int1
NetU3_9: U3.9(DRDy) ; port CaptAccelMagn_DRDY
NetU4_6: U4.6(DRDY/INT2) ; port CaptGyro_DRDY/INT2
NetU4_7: U4.7(INT) ; port CaptGyro_INT

Not connected (* = marked no-connect by the designer): U2 7(PEN) 8(PV); U3 8(Reserved_(NC))

### Notes on the sheet
- Capteur de pression
- Accéléromètre et magnétomètre
- Gyroscope
- Title
- Size:
- Date:
- A3
- Author:
- Time:
- Revision:
- Sheet
- of
- File:

### Library data of the parts
C3-C5 C8-C11 C13 = CAPA: EtatCommande: Interne; Text Field1: CAPA; Supplier 1: Digi-Key
  C3 C4 C9: Supplier Part Number 1: 490-1524-1-ND
  C5 C10: Supplier Part Number 1: 478-1417-1-ND
  C8: Supplier Part Number 1: C0805C475K4PACTU-ND
  C11: Supplier Part Number 1: C0805C103K4RACTU-ND
  C13: Supplier Part Number 1: 587-1250-1-ND
C6 = CAPA: EtatCommande: Commandé; Text Field1: CAPA; Supplier 1: Digi-Key; Supplier Part Number 1: 587-1306-1-ND
R2-R6 = RES: as R1 on sheet Alimentation; Supplier 1: Digi-Key
  R2 R3 R5 R6: Supplier Part Number 1: P10KACT-ND
  R4: Supplier Part Number 1: P10KADKR-ND
U2 = MS5534B: Barometer Module; EtatCommande: Commandé; Supplier 1: Digi-Key; Supplier Part Number 1: 223-1100-1-ND
U3 = LSM303DLHC: Accéléromètre et magnétomètre; EtatCommande: Commandé; Supplier 1: Digi-Key; Supplier Part Number 1: 497-11918-1-ND
U4 = L3G4200D: Gyroscope; EtatCommande: Commandé; Part Name: L3G4200D; Supplier 1: Digi-Key; Supplier Part Number 1: 497-11071-1-ND

## Sheet InterfaceDataTelemetrie.SchDoc
size A3; Organization: Altium Limited; Address1: Laboratoire de Systèmes Embarqués; Address2: 7, rue de la Serre; Address3: 2610 Saint-Imier / Switzerland; PageSetup: Record=PageOptions|CenterHorizontal=True|CenterVertical=True|PrintScale=0.24|XCorrection=1.00|YCorrection=1.00|PrintKind=0|BorderSize=5000000|LeftOffset=0|BottomOffset=0|Orientation=2|PaperLength=1000|PaperWidth=1000|Scale=100|PaperSource=7|PrintQuality=-4|MediaType=1|DitherType=10|PaperKind=A4|PrintScaleMode=1
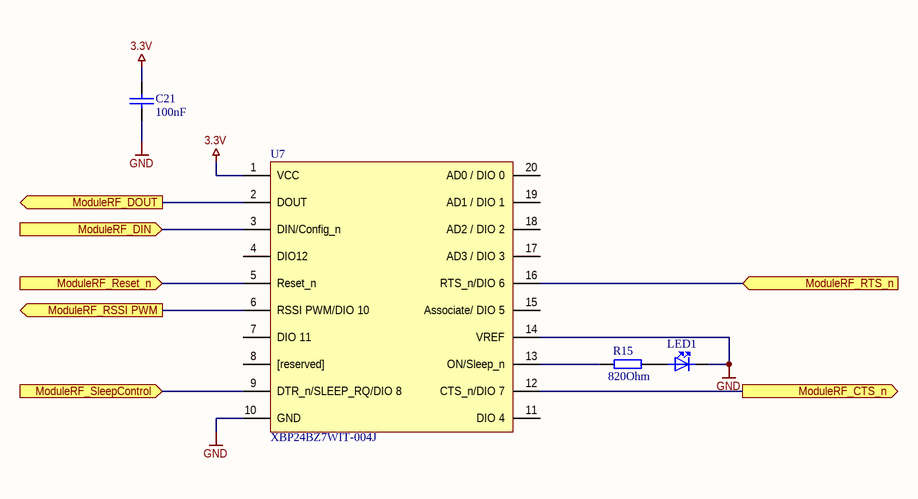
[diagram p5: InterfaceDataTelemetrie.SchDoc]

### Parts
C21  value 100nF  [060301]  (hidden comment: GRM188R71E104KA01D)
LED1  LG L29K-G2J1-24-Z  [060301_led]  (value not drawn)
R15  value 820Ohm  [080501]  (hidden comment: RMCF0805JT820R)
U7  XBP24BZ7WIT-004J  [XBee-Pro]

### Ports
ModuleRF_CTS_n (out), ModuleRF_DIN (in), ModuleRF_DOUT (out), ModuleRF_Reset_n (in), ModuleRF_RSSI PWM (out), ModuleRF_RTS_n (in), ModuleRF_SleepControl (in)

### Nets
3.3V: C21.1 U7.1(VCC)
GND: C21.2 LED1.2(CATHODE) U7.10(GND) U7.14(VREF)
NetLED1_1: LED1.1(ANODE) R15.2
NetR15_1: R15.1 U7.13(ON/Sleep_n)
NetU7_2: U7.2(DOUT) ; port ModuleRF_DOUT
NetU7_3: U7.3(DIN/Config_n) ; port ModuleRF_DIN
NetU7_5: U7.5(Reset_n) ; port ModuleRF_Reset_n
NetU7_6: U7.6(RSSI_PWM/DIO_10) ; port ModuleRF_RSSI PWM
NetU7_9: U7.9(DTR_n/SLEEP_RQ/DIO_8) ; port ModuleRF_SleepControl
NetU7_12: U7.12(CTS_n/DIO_7) ; port ModuleRF_CTS_n
NetU7_16: U7.16(RTS_n/DIO_6) ; port ModuleRF_RTS_n

Not connected (* = marked no-connect by the designer): U7 4(DIO12) 7(DIO_11) 8([reserved]) 11(DIO_4) 15(Associate/_DIO_5) 17(AD3_/_DIO_3) 18(AD2_/_DIO_2) 19(AD1_/_DIO_1) 20(AD0_/_DIO_0)

### Notes on the sheet
- Title
- Size:
- Date:
- A3
- Author:
- Time:
- Revision:
- Sheet
- of
- File:

### Library data of the parts
C21 = CAPA: EtatCommande: Interne; Text Field1: CAPA; Supplier 1: Digi-Key; Supplier Part Number 1: 490-1524-1-ND
LED1 = LED: EtatCommande: Commandé; Supplier 1: Digi-Key; Supplier Part Number 1: 475-2709-1-ND; Text Field1: LED
R15 = RES: as R1 on sheet Alimentation; Supplier 1: Digi-Key; Supplier Part Number 1: RMCF0805JT820RDKR-ND
U7 = MaxStream XBee-PRO: EtatCommande: Commandé; Supplier 1: Mouser; Supplier Part Number 1: 888-XBP24BZ7WIT-004J

## Nets that join several sheets
3.3V: Alimentation (5 pins), Microcontroleur (20 pins), ControlCommande&Motors (6 pins), Capteurs (14 pins), InterfaceDataTelemetrie (C21.1 U7.1)
GND: Alimentation (5 pins), Microcontroleur (35 pins), ControlCommande&Motors (24 pins), MesureAlimentation (11 pins), Capteurs (18 pins), InterfaceDataTelemetrie (C21.2 LED1.2 U7.10 U7.14)
VBat: Alimentation (C2.1 U1.2 U1.3), MesureAlimentation (7 pins)
NetC23_1: Microcontroleur (U9.10), MesureAlimentation (C23.1 R17.2)
NetR2_1: Microcontroleur (U9.53), Capteurs (R2.1 U3.2)
NetR3_1: Microcontroleur (U9.54), Capteurs (R3.1 U3.3)
NetR4_1: Microcontroleur (U9.82), Capteurs (R4.1 U4.2)
NetR5_1: Microcontroleur (U9.83), Capteurs (R5.1 U4.3)
NetR18_2: Microcontroleur (U9.11), MesureAlimentation (R18.2 R19.1)
NetU2_2: Microcontroleur (U9.3), Capteurs (U2.2)
NetU2_3: Microcontroleur (U9.4), Capteurs (U2.3)
NetU2_4: Microcontroleur (U9.2), Capteurs (U2.4)
NetU2_5: Microcontroleur (U9.64), Capteurs (U2.5)
NetU3_4: Microcontroleur (U9.56), Capteurs (U3.4)
NetU3_5: Microcontroleur (U9.55), Capteurs (U3.5)
NetU3_9: Microcontroleur (U9.57), Capteurs (U3.9)
NetU4_6: Microcontroleur (U9.85), Capteurs (U4.6)
NetU4_7: Microcontroleur (U9.84), Capteurs (U4.7)
NetU5_2: Microcontroleur (U9.71), ControlCommande&Motors (U5.2)
NetU5_4: Microcontroleur (U9.72), ControlCommande&Motors (U5.4)
NetU5_6: Microcontroleur (U9.76), ControlCommande&Motors (U5.6)
NetU5_8: Microcontroleur (U9.73), ControlCommande&Motors (U5.8)
NetU6_1: Microcontroleur (U9.97), ControlCommande&Motors (U6.1)
NetU6_3: Microcontroleur (U9.98), ControlCommande&Motors (U6.3)
NetU6_5: Microcontroleur (U9.99), ControlCommande&Motors (U6.5)
NetU6_9: Microcontroleur (U9.100), ControlCommande&Motors (U6.9)
NetU7_2: Microcontroleur (U9.45), InterfaceDataTelemetrie (U7.2)
NetU7_3: Microcontroleur (U9.44), InterfaceDataTelemetrie (U7.3)
NetU7_5: Microcontroleur (U9.43), InterfaceDataTelemetrie (U7.5)
NetU7_6: Microcontroleur (U9.65), InterfaceDataTelemetrie (U7.6)
NetU7_9: Microcontroleur (U9.42), InterfaceDataTelemetrie (U7.9)
NetU7_12: Microcontroleur (U9.46), InterfaceDataTelemetrie (U7.12)
NetU7_16: Microcontroleur (U9.47), InterfaceDataTelemetrie (U7.16)